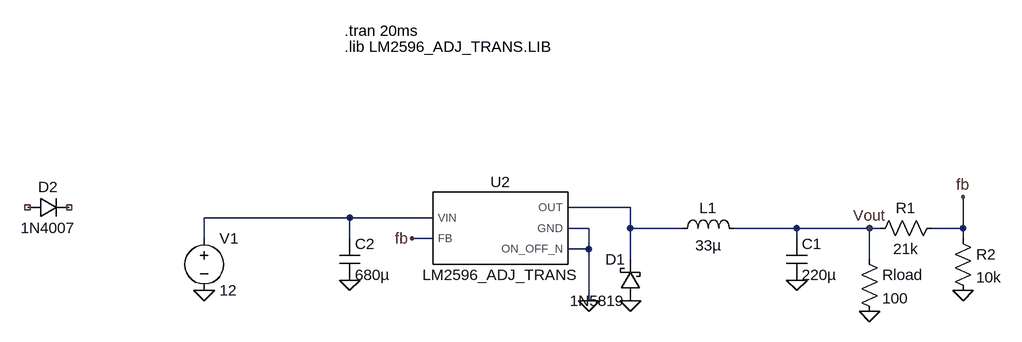
[diagram p0: schematic Buck_converter_testing.asc]
Buck_converter_testing.asc, the LTspice schematic file:
Version 4.1
SHEET 1 880 680
WIRE 128 128 32 128
WIRE -304 144 -528 144
WIRE -176 144 -304 144
WIRE 64 160 32 160
WIRE 128 160 128 128
WIRE 208 160 128 160
WIRE 384 160 288 160
WIRE 496 160 384 160
WIRE 512 160 496 160
WIRE 640 160 640 112
WIRE 640 160 592 160
WIRE -528 176 -528 144
WIRE -304 176 -304 144
WIRE -176 176 -208 176
WIRE 384 176 384 160
WIRE 640 176 640 160
WIRE 64 192 64 160
WIRE 64 192 32 192
WIRE 128 208 128 160
WIRE 496 208 496 160
WIRE 64 272 64 192
FLAG 128 272 0
FLAG 384 240 0
FLAG 640 256 0
FLAG -304 240 0
FLAG -528 256 0
FLAG 64 272 0
FLAG -208 176 fb
FLAG 640 112 fb
FLAG 496 288 0
FLAG 496 160 Vout
SYMBOL schottky 144 272 R180
WINDOW 0 24 64 Left 2
WINDOW 3 24 0 Left 2
SYMATTR InstName D1
SYMATTR Value 1N5819
SYMBOL diode -800 144 R270
WINDOW 0 32 32 VTop 2
WINDOW 3 0 32 VBottom 2
SYMATTR InstName D2
SYMATTR Value 1N4007
SYMBOL ind 192 176 R270
WINDOW 0 32 56 VTop 2
WINDOW 3 5 56 VBottom 2
SYMATTR InstName L1
SYMATTR Value 33µ
SYMATTR SpiceLine Rser=1m
SYMBOL cap 368 176 R0
SYMATTR InstName C1
SYMATTR Value 220µ
SYMBOL res 608 144 R90
WINDOW 0 0 56 VBottom 2
WINDOW 3 32 56 VTop 2
SYMATTR InstName R1
SYMATTR Value 21k
SYMBOL res 624 160 R0
SYMATTR InstName R2
SYMATTR Value 10k
SYMBOL cap -320 176 R0
SYMATTR InstName C2
SYMATTR Value 680µ
SYMBOL voltage -528 160 R0
WINDOW 123 0 0 Left 0
WINDOW 39 0 0 Left 0
SYMATTR InstName V1
SYMATTR Value 12
SYMBOL LM2596_ADJ_TRANS -80 160 R0
SYMATTR InstName U2
SYMBOL res 480 192 R0
SYMATTR InstName Rload
SYMATTR Value 100
TEXT -312 -144 Left 2 !.tran 20ms
TEXT -312 -120 Left 2 !.lib LM2596_ADJ_TRANS.LIB

The netlist it stands for:
* Buck_converter_testing.asc
D1 0 N001 1N5819
D2 NC_01 NC_02 1N4007
L1 N001 Vout 33µ Rser=1m
C1 Vout 0 220µ
R1 fb Vout 21k
R2 fb 0 10k
C2 N002 0 680µ
V1 N002 0 12
X§U2 N002 fb N001 0 0 LM2596_ADJ_TRANS  ; pins VIN FB OUT GND ON_OFF_N
Rload Vout 0 100
.model D D
.lib standard.dio
.tran 20ms
.lib LM2596_ADJ_TRANS.LIB
.lib LM2596_ADJ_TRANS.LIB
.backanno
.end